# Altium project BaseStation.PrjPcb
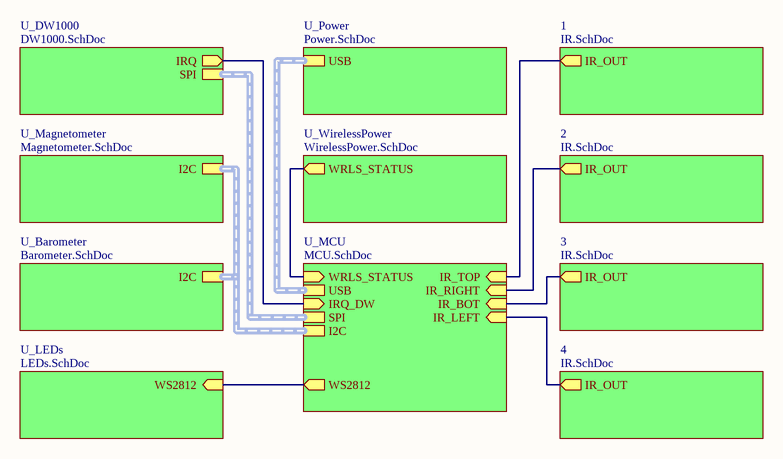
[diagram p0: BaseStation.SchDoc]
9 sheets, 157 parts. Net scope: hierarchical (ports join the sheet entries above them; power ports are global).
Board file: BaseStation.PcbDoc
Sheets:
  BaseStation.SchDoc
    U_MCU = MCU.SchDoc
    U_DW1000 = DW1000.SchDoc
    U_Barometer = Barometer.SchDoc
    1 = IR.SchDoc
    2 = IR.SchDoc
    3 = IR.SchDoc
    4 = IR.SchDoc
    U_LEDs = LEDs.SchDoc
    U_Magnetometer = Magnetometer.SchDoc
    U_Power = Power.SchDoc
    U_WirelessPower = WirelessPower.SchDoc

## Sheet BaseStation.SchDoc
size A; SheetNumber: 1

### Sub-sheets
1 = IR.SchDoc: IR_OUT (out)
2 = IR.SchDoc: IR_OUT (out)
3 = IR.SchDoc: IR_OUT (out)
4 = IR.SchDoc: IR_OUT (out)
U_Barometer = Barometer.SchDoc: I2C (harness I2C)
U_DW1000 = DW1000.SchDoc: SPI (harness SPI), IRQ (out)
U_LEDs = LEDs.SchDoc: WS2812 (in)
U_Magnetometer = Magnetometer.SchDoc: I2C (harness I2C)
U_MCU = MCU.SchDoc: USB (harness USB), I2C (harness I2C), SPI (harness SPI), WRLS_STATUS (in), IRQ_DW (in), WS2812 (out), IR_TOP (in), IR_BOT (in), IR_LEFT (in), IR_RIGHT (in)
U_Power = Power.SchDoc: USB (harness USB)
U_WirelessPower = WirelessPower.SchDoc: WRLS_STATUS (out)

### Nets
NetD4_4: sheet U_MCU/WS2812, sheet U_LEDs/WS2812
NetR37_2: sheet U_MCU/WRLS_STATUS, sheet U_WirelessPower/WRLS_STATUS
NetU4_45: sheet U_MCU/IRQ_DW, sheet U_DW1000/IRQ
NetU5_1_3: sheet U_MCU/IR_TOP, sheet 1/IR_OUT
NetU5_2_3: sheet U_MCU/IR_RIGHT, sheet 2/IR_OUT
NetU5_3_3: sheet U_MCU/IR_BOT, sheet 3/IR_OUT
NetU5_4_3: sheet U_MCU/IR_LEFT, sheet 4/IR_OUT

### Buses and harness runs
harness sheet U_Barometer/I2C = sheet U_Magnetometer/I2C = sheet U_MCU/I2C
harness sheet U_DW1000/SPI = sheet U_MCU/SPI
harness sheet U_MCU/USB = sheet U_Power/USB

## Sheet MCU.SchDoc
size A; SheetNumber: 2
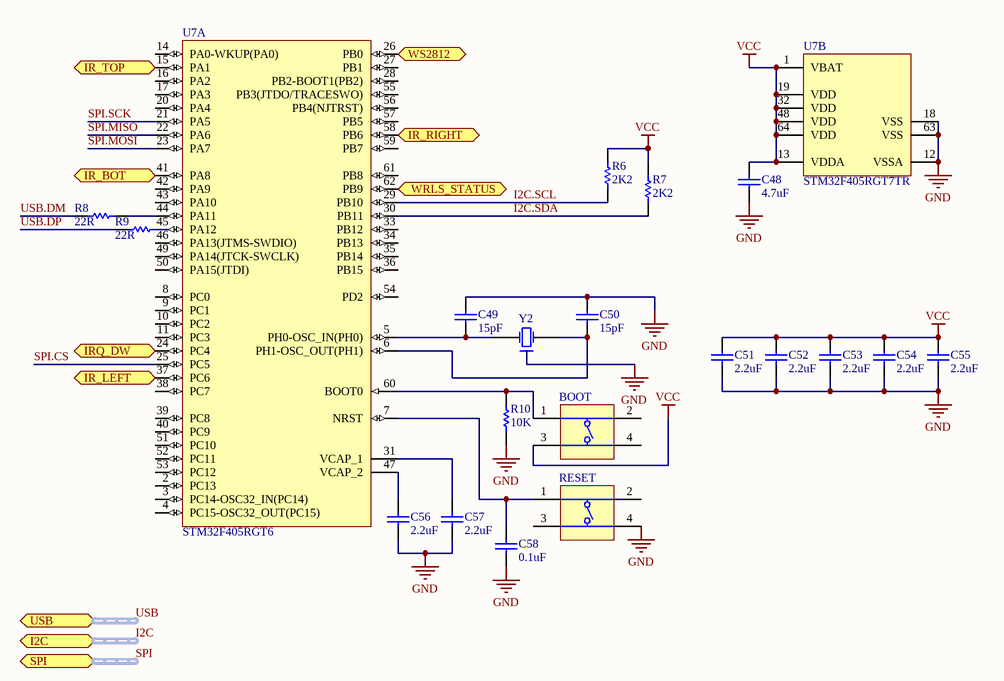
[diagram p1: MCU.SchDoc]

### Parts
BOOT  (no value)  [SWITCH]
C48  value 4.7uF  [C0402[1005X55]]  (hidden comment: 4.7uF 6.3V 0402)
C49  value 15pF  [C0402[1005X55]]  (hidden comment: 15pF 50V 0402)
C50  value 15pF  [C0402[1005X55]]  (hidden comment: 15pF 50V 0402)
C51  value 2.2uF  [C0402[1005X55]]  (hidden comment: 2.2uF 6.3V 0402)
C52  value 2.2uF  [C0402[1005X55]]  (hidden comment: 2.2uF 6.3V 0402)
C53  value 2.2uF  [C0402[1005X55]]  (hidden comment: 2.2uF 6.3V 0402)
C54  value 2.2uF  [C0402[1005X55]]  (hidden comment: 2.2uF 6.3V 0402)
C55  value 2.2uF  [C0402[1005X55]]  (hidden comment: 2.2uF 6.3V 0402)
C56  value 2.2uF  [C0402[1005X55]]  (hidden comment: 2.2uF 6.3V 0402)
C57  value 2.2uF  [C0402[1005X55]]  (hidden comment: 2.2uF 6.3V 0402)
C58  value 0.1uF  [C0402[1005X55]]  (hidden comment: 0.1uF 6.3V 0402)
R6  value 2K2  [R0402[1005]]  (hidden comment: 2K2 1% 0402)
R7  value 2K2  [R0402[1005]]  (hidden comment: 2K2 1% 0402)
R8  value 22R  [R0402[1005]]  (hidden comment: 22R 1% 0402)
R9  value 22R  [R0402[1005]]  (hidden comment: 22R 1% 0402)
R10  value 10K  [R0402[1005]]  (hidden comment: 10K 1% 0402)
RESET  (no value)  [SWITCH]
U7  STM32F405RGT6  [STM-LQFP64_L]  (parts A,B of 2)
Y2  (no value)  [ABRA-ABM3B-4_V]

### Ports
I2C (harness I2C), IR_BOT (in), IR_LEFT (in), IR_RIGHT (in), IR_TOP (in), IRQ_DW (in), SPI (harness SPI), USB (harness USB), WRLS_STATUS (in), WS2812 (out)

### Nets
GND: C48.1 C49.2 C50.2 C51.1 C52.1 C53.1 C54.1 C55.1 C56.1 C57.1 C58.1 R10.1 RESET.4(T3) U7.12(VSSA) U7.18(VSS) U7.63(VSS) Y2.2
VCC: BOOT.3(T3) C48.2 C51.2 C52.2 C53.2 C54.2 C55.2 R6.2 R7.2 U7.1(VBAT) U7.13(VDDA) U7.19(VDD) U7.32(VDD) U7.48(VDD) U7.64(VDD)
I2C.SCL: R6.1 U7.29(PB10)
I2C.SDA: R7.1 U7.30(PB11)
SPI.CS: U7.25(PC5)
SPI.MISO: U7.22(PA6)
SPI.MOSI: U7.23(PA7)
SPI.SCK: U7.21(PA5)
USB.DM: R8.1
USB.DP: R9.1
NetBOOT_1: BOOT.1(T1) R10.2 U7.60(BOOT0)
NetC49_1: C49.1 U7.5(PH0-OSC_IN(PH0)) Y2.3(X2)
NetC50_1: C50.1 U7.6(PH1-OSC_OUT(PH1)) Y2.1(X1)
NetC56_2: C56.2 U7.47(VCAP_2)
NetC57_2: C57.2 U7.31(VCAP_1)
NetC58_2: C58.2 RESET.1(T1) U7.7(NRST)
NetD4_4: U7.26(PB0) ; port WS2812
NetR8_2: R8.2 U7.44(PA11)
NetR9_2: R9.2 U7.45(PA12)
NetR37_2: U7.62(PB9) ; port WRLS_STATUS
NetU4_45: U7.24(PC4) ; port IRQ_DW
NetU5_1_3: U7.15(PA1) ; port IR_TOP
NetU5_2_3: U7.58(PB6) ; port IR_RIGHT
NetU5_3_3: U7.41(PA8) ; port IR_BOT
NetU5_4_3: U7.37(PC6) ; port IR_LEFT

Not connected (* = marked no-connect by the designer): BOOT 2(T2) 4(T3); RESET 2(T2) 3(T3); U7 2(PC13) 3(PC14-OSC32_IN(PC14)) 4(PC15-OSC32_OUT(PC15)) 8(PC0) 9(PC1) 10(PC2) 11(PC3) 14(PA0-WKUP(PA0)) 16(PA2) 17(PA3) 20(PA4) 27(PB1) 28(PB2-BOOT1(PB2)) 33(PB12) 34(PB13) 35(PB14) 36(PB15) 38(PC7) 39(PC8) 40(PC9) 42(PA9) 43(PA10) 46(PA13(JTMS-SWDIO)) 49(PA14(JTCK-SWCLK)) 50(PA15(JTDI)) 51(PC10) 52(PC11) 53(PC12) 54(PD2) 55(PB3(JTDO/TRACESWO)) 56(PB4(NJTRST)) 57(PB5) 59(PB7) 61(PB8)

### Buses and harness runs
harness I2C = port I2C
harness SPI = port SPI
harness USB = port USB

### Library data of the parts
BOOT RESET = DIPT-DTSM-6: Switch, SPNO Push Button SMD; Manufacturer: C&K Components; PartNumber: PTS810 SJM 250 SMTR LFS; Packing Type: Tape&Reel; Mechanical Life: 200,000 cycles; ComponentLink2URL: http://www.dip.com.tw/Products_tact.htm; ComponentLink1URL: http://www.dip.com.tw/; ComponentLink3URL: http://www.dip.com.tw/PDF/pro_tact/DTSM_G_-6_2_-V.pdf; PackageDescription: Switch, Surface Mount, 4 Leads, Body 4.6x2.8mm, Height 1.9mm; ComponentLink2Description: Datasheet; ComponentLink3Description: Package Specification; ComponentLink1Description: Manufacturer URL; PackageReference: PTS810; Mounting Technology: Surface Mount
C48 = CAP_4.7uF_6.3V_0402_20%: 4.7uF 6.3V 20% 0402 (1005 Metric); PartNumber: GRM155R60J475ME47D; Manufacturer: Murata; Tolerance: 20%; Mounting Technology: Surface Mount; PackageReference: 0402; PackageDescription: 0402 (1005 Metric); Voltage: 6.3V
C49 C50 = CAP_15pF_50V_0402_5%: 15pF 50V 5% 0402 (1005 Metric); PartNumber: GRM1555C1H150JA01D; Manufacturer: Murata; Tolerance: 5%; Mounting Technology: Surface Mount; PackageReference: 0402; PackageDescription: 0402 (1005 Metric); Voltage: 50V
C51-C57 = CAP_2.2uF_6.3V_0402_20%: 2.2uF 6.3V 20% 0402 (1005 Metric); PartNumber: GRM155R60J225ME15D; Manufacturer: Murata; Tolerance: 20%; Mounting Technology: Surface Mount; PackageReference: 0402; PackageDescription: 0402 (1005 Metric); Voltage: 6.3V
C58 = CAP_0.1uF_6.3V_0402_10%: 0.1uF 6.3V 10% 0402 (1005 Metric); PartNumber: GRM155R70J104KA01D; Manufacturer: Murata; Tolerance: 10%; Mounting Technology: Surface Mount; PackageReference: 0402; PackageDescription: 0402 (1005 Metric); Voltage: 6.3V
R6 R7 = RES_2K2_0402_1%: 2K2 0.063W 1% 0402 (1005 Metric); Manufacturer: KOA Speer; PartNumber: RK73H1ETTP2201F; Tolerance: 1%; Power: 0.063W; Mounting Technology: Surface Mount; PackageReference: 0402; PackageDescription: 0402 (1005 Metric); ComponentLink1Description: Datasheet; ComponentLink1URL: http://www.koaspeer.com/catimages/Products/RK73H/RK73H.pdf
R8 R9 = RES_22R_0402_1%: 22R 0.063W 1% 0402 (1005 Metric); Manufacturer: KOA Speer; PartNumber: RK73H1ETTP22R0F; Power: 0.063W; Tolerance: 1%; Mounting Technology: Surface Mount; PackageReference: 0402; PackageDescription: 0402 (1005 Metric); ComponentLink1Description: Datasheet; ComponentLink1URL: http://www.koaspeer.com/catimages/Products/RK73H/RK73H.pdf
R10 = RES_10K_0402_1%: 10K 0.063W 1% 0402 (1005 Metric); Manufacturer: KOA Speer; PartNumber: RK73H1ETTP1002F; Tolerance: 1%; Power: 0.063W; Mounting Technology: Surface Mount; PackageReference: 0402; PackageDescription: 0402 (1005 Metric); ComponentLink1Description: Datasheet; ComponentLink1URL: http://www.koaspeer.com/catimages/Products/RK73H/RK73H.pdf
U7 = CMP-0243-00089-2: ARM Cortex-M4 32-bit MCU+FPU, 210 DMIPS, 1024 kB Flash, 192 kB Internal RAM, 51 I/Os, 64-pin LQFP, -40 to 105 degC, Tape and Reel; Manufacturer: STMicroelectronics; FLASH Size (Prog) (kB): 1024; Supply Voltage(Vcc) max (V): 3.6; Internal RAM Size (kB): 192; Supply Voltage(Vcc) min (V): 1.8; Operating Frequency(F) (Processor speed) (MHz): 168; D/A Converter: 2x12-bit; I/Os (High Current): 51; ComponentLink2Description: Datasheet; Core: ARM Cortex-M4; PackageVersion: Rev. 4, 06/2013; ComponentLink1URL: http://www.st.com/web/en/home.html; PackageReference: LQFP64; Mounting Technology: Surface Mount; ComponentLink1Description: Manufacturer URL; PackageDescription: 64-Pin Low Profile Quad Flat Package, 10 x 10 mm Body, 0.5 mm Pitch; ComponentLink3Description: Package Specification; ComponentLink2URL: http://www.st.com/st-web-ui/static/active/en/resource/technical/document/datasheet/DM00037051.pdf; PartNumber: STM32F405RGT6; ComponentLink3URL: http://www.st.com/st-web-ui/static/active/en/resource/technical/document/datasheet/DM00037051.pdf; Packing: Tape and Reel; DatasheetVersion: Rev. 4; PartId: 1
Y2 = ABRA-ABM3B-4: PartNumber: ABM3B-8.000MHZ-10-1UT; Manufacturer: ABRACON; Mounting Technology: Surface Mount; PackageReference: 2012; PackageDescription: 2012 (5032 metric)

## Sheet DW1000.SchDoc
size A; SheetNumber: 5
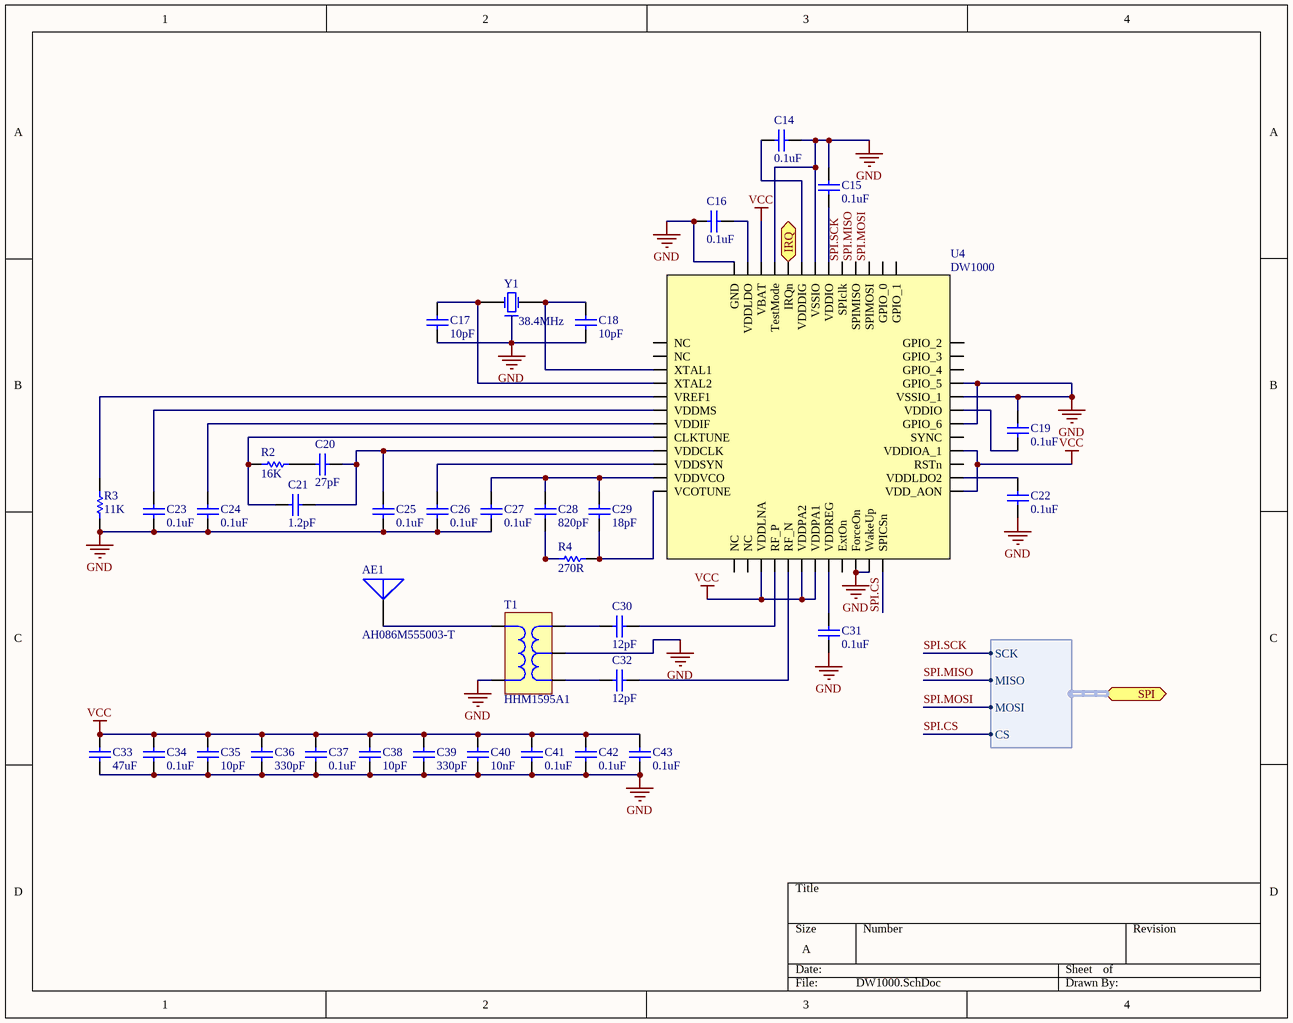
[diagram p2: DW1000.SchDoc]

### Parts
AE1  AH086M555003-T  [AH086M555003-T]
C14  value 0.1uF  [C0402[1005X55]]  (hidden comment: 0.1uF 6.3V 0402)
C15  value 0.1uF  [C0402[1005X55]]  (hidden comment: 0.1uF 6.3V 0402)
C16  value 0.1uF  [C0402[1005X55]]  (hidden comment: 0.1uF 6.3V 0402)
C17  value 10pF  [C0402[1005X55]]  (hidden comment: 10pF 50V 0402)
C18  value 10pF  [C0402[1005X55]]  (hidden comment: 10pF 50V 0402)
C19  value 0.1uF  [C0402[1005X55]]  (hidden comment: 0.1uF 6.3V 0402)
C20  value 27pF  [C0402[1005X55]]  (hidden comment: 27pF 50V 0402)
C21  value 1.2pF  [C0402[1005X55]]  (hidden comment: 1.2pF 50V 0402)
C22  value 0.1uF  [C0402[1005X55]]  (hidden comment: 0.1uF 6.3V 0402)
C23  value 0.1uF  [C0402[1005X55]]  (hidden comment: 0.1uF 6.3V 0402)
C24  value 0.1uF  [C0402[1005X55]]  (hidden comment: 0.1uF 6.3V 0402)
C25  value 0.1uF  [C0402[1005X55]]  (hidden comment: 0.1uF 6.3V 0402)
C26  value 0.1uF  [C0402[1005X55]]  (hidden comment: 0.1uF 6.3V 0402)
C27  value 0.1uF  [C0402[1005X55]]  (hidden comment: 0.1uF 6.3V 0402)
C28  value 820pF  [C0402[1005X55]]  (hidden comment: 820pF 50V 0402)
C29  value 18pF  [C0402[1005X55]]  (hidden comment: 18pF 50V 0402)
C30  value 12pF  [C0402[1005X55]]  (hidden comment: 12pF 50V 0402)
C31  value 0.1uF  [C0402[1005X55]]  (hidden comment: 0.1uF 6.3V 0402)
C32  value 12pF  [C0402[1005X55]]  (hidden comment: 12pF 50V 0402)
C33  value 47uF  [C1206[3216X160]]  (hidden comment: 47uF 6.3V 1206)
C34  value 0.1uF  [C0402[1005X55]]  (hidden comment: 0.1uF 6.3V 0402)
C35  value 10pF  [C0402[1005X55]]  (hidden comment: 10pF 50V 0402)
C36  value 330pF  [C0402[1005X55]]  (hidden comment: 330pF 50V 0402)
C37  value 0.1uF  [C0402[1005X55]]  (hidden comment: 0.1uF 6.3V 0402)
C38  value 10pF  [C0402[1005X55]]  (hidden comment: 10pF 50V 0402)
C39  value 330pF  [C0402[1005X55]]  (hidden comment: 330pF 50V 0402)
C40  value 10nF  [C0402[1005X55]]  (hidden comment: 10nF 50V 0402)
C41  value 0.1uF  [C0402[1005X55]]  (hidden comment: 0.1uF 6.3V 0402)
C42  value 0.1uF  [C0402[1005X55]]  (hidden comment: 0.1uF 6.3V 0402)
C43  value 0.1uF  [C0402[1005X55]]  (hidden comment: 0.1uF 6.3V 0402)
R2  value 16K  [R0402[1005]]  (hidden comment: 16K 1% 0402)
R3  value 11K  [R0402[1005]]  (hidden comment: 11K 1% 0402)
R4  value 270R  [R0402[1005]]  (hidden comment: 270R 1% 0402)
T1  HHM1595A1  [HHM1595A1]
U4  DW1000  [QFN-48]
Y1  38.4MHz  [ABRA-ABM10]

### Ports
IRQ (out), SPI (harness SPI)

### Harnesses
SPI: SCK, MISO, MOSI, CS

### Nets
GND: C14.1 C15.2 C16.2 C17.1 C18.1 C19.2 C22.1 C23.1 C24.1 C25.1 C26.1 C27.1 C31.1 C33.1 C34.1 C35.1 C36.1 C37.1 C38.1 C39.1 C40.1 C41.1 C42.1 C43.1 R3.1 T1.2 T1.5 U4.22(ForceOn) U4.23(WakeUp) U4.30(GPIO_6) U4.32(VSSIO_1) U4.33(GPIO_5) U4.43(VSSIO) U4.46(TestMode) U4.49(GND) Y1.2
VCC: C33.2 C34.2 C35.2 C36.2 C37.2 C38.2 C39.2 C40.2 C41.2 C42.2 C43.2 U4.15(VDDLNA) U4.18(VDDPA2) U4.19(VDDPA1) U4.25(VDD_AON) U4.28(VDDIOA_1) U4.47(VBAT)
SPI.CS: U4.24(SPICSn) ; port SPI.CS
SPI.MISO: U4.40(SPIMISO) ; port SPI.MISO
SPI.MOSI: U4.39(SPIMOSI) ; port SPI.MOSI
SPI.SCK: U4.41(SPIclk) ; port SPI.SCK
NetAE1_1: AE1.1 T1.1
NetC14_2: C14.2 U4.44(VDDDIG)
NetC15_1: C15.1 U4.42(VDDIO)
NetC16_1: C16.1 U4.48(VDDLDO)
NetC17_2: C17.2 U4.4(XTAL2) Y1.1(X1)
NetC18_2: C18.2 U4.3(XTAL1) Y1.3(X2)
NetC19_1: C19.1 U4.31(VDDIO)
NetC20_1: C20.1 C21.1 C25.2 U4.9(VDDCLK)
NetC20_2: C20.2 R2.1
NetC21_2: C21.2 R2.2 U4.8(CLKTUNE)
NetC22_2: C22.2 U4.26(VDDLDO2)
NetC23_2: C23.2 U4.6(VDDMS)
NetC24_2: C24.2 U4.7(VDDIF)
NetC26_2: C26.2 U4.10(VDDSYN)
NetC27_2: C27.2 C28.2 C29.2 U4.11(VDDVCO)
NetC28_1: C28.1 R4.1
NetC29_1: C29.1 R4.2 U4.12(VCOTUNE)
NetC30_1: C30.1 T1.4
NetC30_2: C30.2 U4.16(RF_P)
NetC31_2: C31.2 U4.20(VDDREG)
NetC32_1: C32.1 T1.3
NetC32_2: C32.2 U4.17(RF_N)
NetR3_2: R3.2 U4.5(VREF1)
NetU4_45: U4.45(IRQn) ; port IRQ

Not connected (* = marked no-connect by the designer): U4 1(NC) 2(NC) 13(NC) 14(NC) 21(ExtOn) 27(RSTn) 29(SYNC) 34(GPIO_4) 35(GPIO_3) 36(GPIO_2) 37(GPIO_1) 38(GPIO_0)

### Library data of the parts
AE1 = AH086M555003-T: Manufacturer: Taiyo Yuden; PartNumber: AH086M555003-T; Mounting Technology: Surface Mount
C14-C16 C19 C22-C27 C31 C34 C37 C41-C43 = CAP_0.1uF_6.3V_0402_10%: as C58 on sheet MCU; Mounting Technology: Surface Mount; PackageReference: 0402; PackageDescription: 0402 (1005 Metric); Voltage: 6.3V; Tolerance: 10%
C17 C18 C35 C38 = CAP_10pF_50V_0402_1%: 10pF 50V 1% 0402 (1005 Metric); PartNumber: GRM1555C1H100FA01D; Manufacturer: Murata; Mounting Technology: Surface Mount; PackageReference: 0402; PackageDescription: 0402 (1005 Metric); Voltage: 50V; Tolerance: 1%
C20 = CAP_27pF_50V_0402_1%: 27pF 50V 1% 0402 (1005 Metric); PartNumber: GRM1555C1H270FA01D; Manufacturer: Murata; Mounting Technology: Surface Mount; PackageReference: 0402; PackageDescription: 0402 (1005 Metric); Voltage: 50V; Tolerance: 1%
C21 = CAP_1.2pF_50V_0402_0.05pF: 1.2pF 50V 0.05pF 0402 (1005 Metric); PartNumber: GRM1555C1H1R2WA01D; Manufacturer: Murata; Mounting Technology: Surface Mount; PackageReference: 0402; PackageDescription: 0402 (1005 Metric); Voltage: 50V; Tolerance: 0.05pF
C28 = CAP_820pF_50V_0402_5%: 820pF 50V 5% 0402 (1005 Metric); PartNumber: GRM1555C1H821JA01D; Manufacturer: Murata; Mounting Technology: Surface Mount; PackageReference: 0402; PackageDescription: 0402 (1005 Metric); Voltage: 50V; Tolerance: 5%
C29 = CAP_18pF_50V_0402_1%: 18pF 50V 1% 0402 (1005 Metric); PartNumber: GRM1555C1H180FA01D; Manufacturer: Murata; Mounting Technology: Surface Mount; PackageReference: 0402; PackageDescription: 0402 (1005 Metric); Voltage: 50V; Tolerance: 1%
C30 C32 = CAP_12pF_50V_0402_5%: 12pF 50V 5% 0402 (1005 Metric); PartNumber: GRM1555C1H120JA01D; Manufacturer: Murata; Mounting Technology: Surface Mount; PackageReference: 0402; PackageDescription: 0402 (1005 Metric); Voltage: 50V; Tolerance: 5%
C33 = CAP_47uF_6.3V_1206_10%: 47uF 6.3V 10% 1206 (3216 Metric); PartNumber: GRM31CR60J476KE19L; Manufacturer: Murata; Mounting Technology: Surface Mount; PackageReference: 1206; PackageDescription: 1206 (3216 Metric); Voltage: 6.3V; Tolerance: 10%
C36 C39 = CAP_330pF_50V_0402_5%: 330pF 50V 5% 0402 (1005 Metric); PartNumber: GRM1555C1H331JA01D; Manufacturer: Murata; Mounting Technology: Surface Mount; PackageReference: 0402; PackageDescription: 0402 (1005 Metric); Voltage: 50V; Tolerance: 5%
C40 = CAP_10nF_50V_0402_10%: 10nF 50V 10% 0402 (1005 Metric); PartNumber: GCM155R71H103KA55D; Manufacturer: Murata; Mounting Technology: Surface Mount; PackageReference: 0402; PackageDescription: 0402 (1005 Metric); Voltage: 50V; Tolerance: 10%
R2 = RES_16K_0402_1%: 16K 0.063W 1% 0402 (1005 Metric); Manufacturer: KOA Speer; PartNumber: RK73H1ETTP1602F; Tolerance: 1%; Power: 0.063W; Mounting Technology: Surface Mount; PackageReference: 0402; PackageDescription: 0402 (1005 Metric); ComponentLink1Description: Datasheet; ComponentLink1URL: http://www.koaspeer.com/catimages/Products/RK73H/RK73H.pdf
R3 = RES_11K_0402_1%: 11K 0.063W 1% 0402 (1005 Metric); Manufacturer: KOA Speer; PartNumber: RK73H1ETTP1102F; Tolerance: 1%; Power: 0.063W; Mounting Technology: Surface Mount; PackageReference: 0402; PackageDescription: 0402 (1005 Metric); ComponentLink1Description: Datasheet; ComponentLink1URL: http://www.koaspeer.com/catimages/Products/RK73H/RK73H.pdf
R4 = RES_270R_0402_1%: 270R 0.063W 1% 0402 (1005 Metric); Manufacturer: KOA Speer; PartNumber: RK73H1ETTP2700F; Tolerance: 1%; Power: 0.063W; Mounting Technology: Surface Mount; PackageReference: 0402; PackageDescription: 0402 (1005 Metric); ComponentLink1Description: Datasheet; ComponentLink1URL: http://www.koaspeer.com/catimages/Products/RK73H/RK73H.pdf
T1 = HHM1595A1: Manufacturer: TDK; PartNumber: HHM1595A1; PackageReference: 0805; Mounting Technology: Surface Mount
U4 = DW1000: UWB DW1000; Part Number: DW1000-I-TR13; Manufacturer: Decawave Limited; PackageReference: QFN-48; Mounting Technology: Surface Mount
Y1 = ABM10-165-38.400MHZ-T3: Manufacturer: ABRACON; PartNumber: ABM10-165-38.400MHZ-T3; Mounting Technology: Surface Mount; PackageReference: 4-SMD; PackageDescription: 4-SMD, No Lead (DFN, LCC)

## Sheet Barometer.SchDoc
size A; SheetNumber: 6
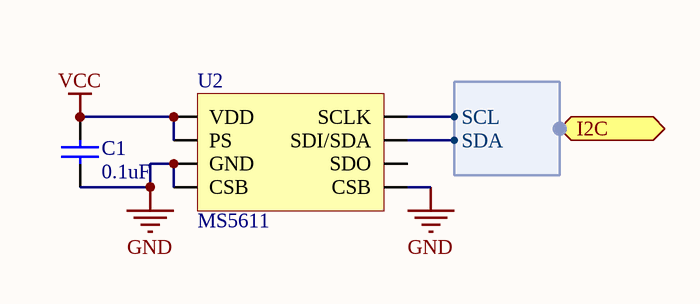
[diagram p3: Barometer.SchDoc]

### Parts
C1  value 0.1uF  [C0402[1005X55]]  (hidden comment: 0.1uF 6.3V 0402)
U2  MS5611  [MS5611]

### Ports
I2C (harness I2C)

### Harnesses
I2C: SCL, SDA

### Nets
GND: C1.1 U2.3(GND) U2.4(CSB) U2.5(CSB)
VCC: C1.2 U2.1(VDD) U2.2(PS)
I2C.SCL: U2.8(SCLK) ; port I2C.SCL
I2C.SDA: U2.7(SDI/SDA) ; port I2C.SDA

Not connected (* = marked no-connect by the designer): U2 6(SDO)

### Library data of the parts
C1 = CAP_0.1uF_6.3V_0402_10%: as C58 on sheet MCU; Tolerance: 10%; Mounting Technology: Surface Mount; PackageReference: 0402; PackageDescription: 0402 (1005 Metric); Voltage: 6.3V

## Sheet IR.SchDoc
size A; SheetNumber: 8
Used 4 times, as channels 1, 2, 3, 4. Parts and nets are listed once, with the designators drawn on the sheet.
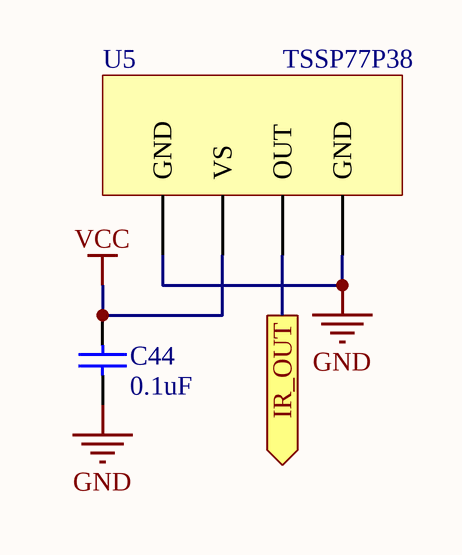
[diagram p4: IR.SchDoc]

### Parts
C44  value 0.1uF  [C0402[1005X55]]  (hidden comment: 0.1uF 6.3V 0402)
U5  TSSP77P38  [TSSP77P38]

### Ports
IR_OUT (out)

### Nets
GND: C44.1 U5.1(GND) U5.4(GND)
VCC: C44.2 U5.2(VS)
IR_OUT: U5.3(OUT) ; port IR_OUT

### Channels
1: designators end in _1; ports IR_OUT=NetU5_1_3
2: designators end in _2; ports IR_OUT=NetU5_2_3
3: designators end in _3; ports IR_OUT=NetU5_3_3
4: designators end in _4; ports IR_OUT=NetU5_4_3

### Library data of the parts
C44 = CAP_0.1uF_6.3V_0402_10%: as C58 on sheet MCU; Mounting Technology: Surface Mount; PackageReference: 0402; PackageDescription: 0402 (1005 Metric); Voltage: 6.3V; Tolerance: 10%
U5 = TSSP77P38: Manufacturer: Vishay; PartNumber: TSSP77P38; Mounting Technology: Surface Mount

## Sheet LEDs.SchDoc
size A; SheetNumber: 9
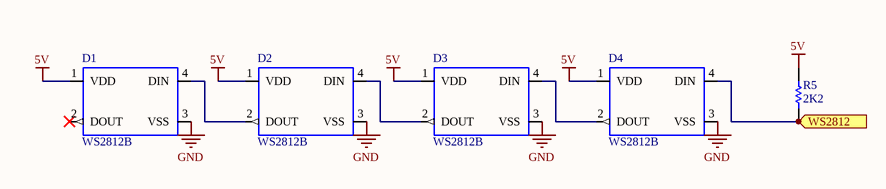
[diagram p5: LEDs.SchDoc]

### Parts
D1  WS2812B  [WS2812B]
D2  WS2812B  [WS2812B]
D3  WS2812B  [WS2812B]
D4  WS2812B  [WS2812B]
R5  value 2K2  [R0402[1005]]  (hidden comment: 2K2 1% 0402)

### Ports
WS2812 (in)

### Nets
5V: D1.1(VDD) D2.1(VDD) D3.1(VDD) D4.1(VDD) R5.2
GND: D1.3(VSS) D2.3(VSS) D3.3(VSS) D4.3(VSS)
NetD1_4: D1.4(DIN) D2.2(DOUT)
NetD2_4: D2.4(DIN) D3.2(DOUT)
NetD3_4: D3.4(DIN) D4.2(DOUT)
NetD4_4: D4.4(DIN) R5.1 ; port WS2812

Not connected (* = marked no-connect by the designer): D1 2(DOUT)*

### Library data of the parts
R5 = RES_2K2_0402_1%: as R6 on sheet MCU; Tolerance: 1%; Power: 0.063W; Mounting Technology: Surface Mount; PackageReference: 0402; PackageDescription: 0402 (1005 Metric); ComponentLink1Description: Datasheet; ComponentLink1URL: http://www.koaspeer.com/catimages/Products/RK73H/RK73H.pdf
D1-D4 = WS2812B: PartNumber: WS2812B

## Sheet Magnetometer.SchDoc
size A; SheetNumber: 7
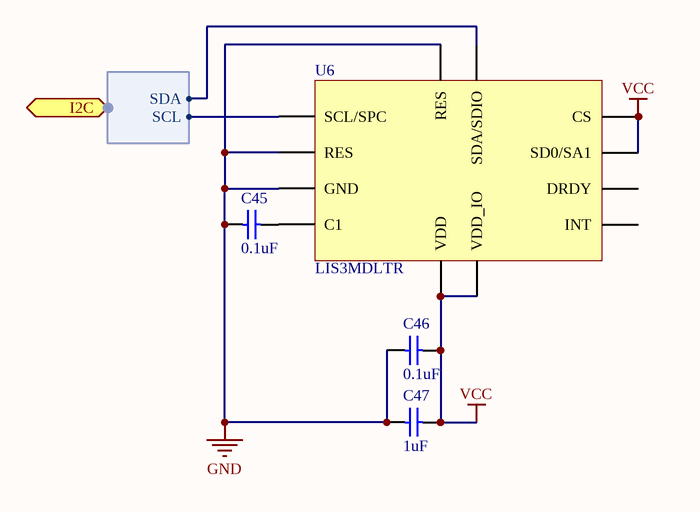
[diagram p6: Magnetometer.SchDoc]

### Parts
C45  value 0.1uF  [C0402[1005X55]]  (hidden comment: 0.1uF 6.3V 0402)
C46  value 0.1uF  [C0402[1005X55]]  (hidden comment: 0.1uF 6.3V 0402)
C47  value 1uF  [C0402[1005X55]]  (hidden comment: 1uF 6.3V 0402)
U6  LIS3MDLTR  [LGA-12 (2x2MM)]

### Ports
I2C (harness I2C)

### Harnesses
I2C: SCL, SDA

### Nets
GND: C45.1 C46.1 C47.1 U6.2(RES) U6.3(GND) U6.12(RES)
VCC: C46.2 C47.2 U6.5(VDD) U6.6(VDD_IO) U6.9(SD0/SA1) U6.10(CS)
I2C.SCL: U6.1(SCL/SPC) ; port I2C.SCL
I2C.SDA: U6.11(SDA/SDIO) ; port I2C.SDA
NetC45_2: C45.2 U6.4(C1)

Not connected (* = marked no-connect by the designer): U6 7(INT) 8(DRDY)

### Library data of the parts
C45 C46 = CAP_0.1uF_6.3V_0402_10%: as C58 on sheet MCU; Mounting Technology: Surface Mount; PackageReference: 0402; PackageDescription: 0402 (1005 Metric); Voltage: 6.3V; Tolerance: 10%
C47 = CAP_1uF_6.3V_0402_10%: 1uF 6.3V 10% 0402 (1005 Metric); PartNumber: GRM155R70J105KA12D; Manufacturer: Murata; Mounting Technology: Surface Mount; PackageReference: 0402; PackageDescription: 0402 (1005 Metric); Voltage: 6.3V; Tolerance: 10%
U6 = LIS3MDLTR: Board Mount Hall Effect / Magnetic Sensors Ultra Lo-Pwr Hi Perf 3-Axis 1.9-3.6V; Manufacturer: STMicroelectronics; PartNumber: LIS3MDLTR; Mounting Technology: Surface Mount; PackageReference: LGA-12

## Sheet Power.SchDoc
size A; SheetNumber: 3
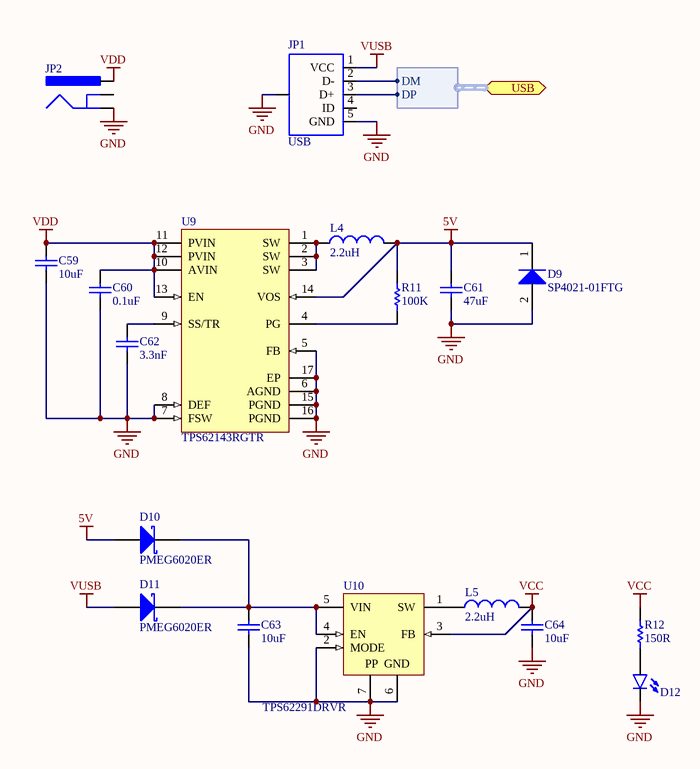
[diagram p7: Power.SchDoc]

### Parts
C59  value 10uF  [C1206[3216X160]]  (hidden comment: 10uF 50V 1206)
C60  value 0.1uF  [C0402[1005X55]]  (hidden comment: 0.1uF 100V 0402)
C61  value 47uF  [C1210[3225X250]]  (hidden comment: 47uF 6.3V 1210)
C62  value 3.3nF  [C0402[1005X55]]  (hidden comment: 3.3nF 50V 0402)
C63  value 10uF  [C0402[1005X55]]  (hidden comment: 10uF 6.3V 0402)
C64  value 10uF  [C0402[1005X55]]  (hidden comment: 10uF 6.3V 0402)
D9  SP4021-01FTG  [SOD-323]
D10  PMEG6020ER  [SOD-123]
D11  PMEG6020ER  [SOD-123]
D12  LED_0603_GREEN_5mA  [LED0603]  (value not drawn)
JP1  USB  [USB-MICROB]
JP2  (no value)  [POWER_JACK_SMD]
L4  2.2uH  [IND0805]
L5  2.2uH  [IND0805]
R11  value 100K  [R0402[1005]]  (hidden comment: 100K 1% 0402)
R12  value 150R  [R0402[1005]]  (hidden comment: 150R 1% 0402)
U9  TPS62143RGTR  [RGT0016C_V]
U10  TPS62291DRVR  [WSON-6]

### Ports
USB (harness USB)

### Harnesses
USB: DM, DP

### Nets
5V: C61.2 D9.1(K) D10.2(A) L4.2 R11.2 U9.14(VOS)
GND: C59.1 C60.1 C61.1 C62.1 C63.1 C64.1 D9.2(A) D12.C JP1.5(GND) JP1.6(SHIELD) JP2.2(GND) U9.5(FB) U9.6(AGND) U9.7(FSW) U9.8(DEF) U9.15(PGND) U9.16(PGND) U9.17(EP) U10.2(MODE) U10.6(GND) U10.7(EP)
VCC: C64.2 L5.2 R12.2 U10.3(FB)
VDD: C59.2 C60.2 JP2.1(PWR) U9.10(AVIN) U9.11(PVIN) U9.12(PVIN) U9.13(EN)
VUSB: D11.2(A) JP1.1(VCC)
USB.DM: JP1.2(D-) ; port USB.DM
USB.DP: JP1.3(D+) ; port USB.DP
NetC62_2: C62.2 U9.9(SS/TR)
NetC63_2: C63.2 D10.1(K) D11.1(K) U10.4(EN) U10.5(VIN)
NetD12_A: D12.A R12.1
NetL4_1: L4.1 U9.1(SW) U9.2(SW) U9.3(SW)
NetL5_1: L5.1 U10.1(SW)
NetR11_1: R11.1 U9.4(PG)

Not connected (* = marked no-connect by the designer): JP1 4(ID); JP2 3(GND)

### Notes on the sheet
- (in symbol TPS62291DRVR) PP

### Library data of the parts
C59 = CAP_10uF_50V_1206_20%: 10uF 50V 20% 1206 (3216 Metric); PartNumber: UMK316BBJ106ML-T; Manufacturer: Taiyo Yuden; Tolerance: 20%; Mounting Technology: Surface Mount; PackageReference: 1206; PackageDescription: 1206 (3216 Metric); Voltage: 50V
C60 = CAP_0.1uF_100V_0402_10%: 0.1uF 100V 10% 0402 (1005 Metric); PartNumber: GRM155R62A104KE14D; Manufacturer: Murata; Tolerance: 10%; Mounting Technology: Surface Mount; PackageReference: 0402; PackageDescription: 0402 (1005 Metric); Voltage: 100V
C61 = CAP_47uF_6.3V_1210_10%: 47uF 6.3V 10% 1210 (3225 Metric); PartNumber: GRM32ER70J476KE20L; Manufacturer: Murata; Tolerance: 10%; Mounting Technology: Surface Mount; PackageReference: 1210; PackageDescription: 1210 (3225 Metric); Voltage: 6.3V
C62 = CAP_3.3nF_50V_0402_10%: 3.3nF 50V 10% 0402 (1005 Metric); PartNumber: GRM155R71H332KA01D; Manufacturer: Murata; Tolerance: 10%; Mounting Technology: Surface Mount; PackageReference: 0402; PackageDescription: 0402 (1005 Metric); Voltage: 50V
C63 C64 = CAP_10uF_6.3V_0402_20%: 10uF 6.3V 20% 0402 (1005 Metric); PartNumber: GRM155R60J106ME44D; Manufacturer: Murata; Tolerance: 20%; Mounting Technology: Surface Mount; PackageReference: 0402; PackageDescription: 0402 (1005 Metric); Voltage: 6.3V
D9 = SP4021-01FTG: Manufacturer: Littelfuse; PartNumber: SP4021-01FTG; PackageReference: SOD-323-2; Mounting Technology: Surface Mount
D10 D11 = PMEG6020ER: PartNumber: PMEG6020ER,115; Manufacturer: NXP Semiconductors; PackageReference: SOD-123W; PackageDescription: SOD, 2-Leads, Body 2.69x1.6mm; Mounting Technology: Surface Mount
D12 = LED_0603_GREEN_5mA: PartNumber: LTST-C193TGKT-5A; Manufacturer: Lite-On Inc.; PackageReference: 0603; PackageDescription: 0603 (1608 Metric); Mounting Technology: Surface Mount
JP1 = USB_MICROB_SMT: pin to pad: 1>VBUS 2>D- 3>D+ 4>ID 5>GND 6>MT1+P$1+P$2+MT2; PartNumber: 10118192-0001LF; Manufacturer: Amphenol FCI; Mounting Technology: Surface Mount; PackageReference: USB - Micro B
JP2 = POWER_JACK
L4 L5 = IND_2.2uH_1.7A_0805_20%: 2.2uH 20% 1.7A 0805; PartNumber: LQM21PN2R2MGHL; Manufacturer: Murata; PackageReference: 0805; PackageDescription: 0805 (2012 metric); Value: 2.2uH; Mounting Technology: Surface Mount; Current: 1.7A
R11 = RES_100K_0402_1%: 100K 0.063W 1% 0402 (1005 Metric); Manufacturer: KOA Speer; PartNumber: RK73H1ETTP1003F; Tolerance: 1%; Power: 0.063W; Mounting Technology: Surface Mount; PackageReference: 0402; PackageDescription: 0402 (1005 Metric); ComponentLink1Description: Datasheet; ComponentLink1URL: http://www.koaspeer.com/catimages/Products/RK73H/RK73H.pdf
R12 = RES_150R_0402_1%: 150R 0.063W 1% 0402 (1005 Metric); Manufacturer: KOA Speer; PartNumber: RK73H1ETTP1500F; Power: 0.063W; Tolerance: 1%; Mounting Technology: Surface Mount; PackageReference: 0402; PackageDescription: 0402 (1005 Metric); ComponentLink1Description: Datasheet; ComponentLink1URL: http://www.koaspeer.com/catimages/Products/RK73H/RK73H.pdf
U9 = CMP-0323-00146-3: Buck Step Down Regulator with 3 to 17 V Input and 5 V Output, -40 to 85 degC, 16-Pin QFN (RGT), Green (RoHS & no Sb/Br); Manufacturer: Texas Instruments; Preset Vout(V): 5; Regulated Outputs(#): 1; Synchronous Rectification: TRUE; Duty Cycle(Max)(%): 100; Vin(Min)(V): 3; Vin(Max)(V): 17; Rating: Catalog; SubFamily: Step-Down Regulator; Switch Current Limit(Typ)(A): 4.2; Iout(Max)(A): 2; Iq(Typ)(mA): 0.017; ComponentLink1Description: Datasheet; PackageVersion: revH, Oct-2011; ComponentLink2URL: http://www.ti.com/litv/pdf/mpqf119g; Code_JEDEC: MO-220; ComponentLink2Description: Package Specification; Vout(Max)(V): 5; ComponentLink3URL: Samples URL:http://www.ti.com/product/tps62133#samples; PackageReference: RGT0016C; ComponentLink3Description: URL Link1; Mounting Technology: Surface Mount; DatasheetVersion: SLVSAG7; PartNumber: TPS62143RGTR; Eco-Plan: Green (RoHS & no Sb/Br); PackageDescription: 16-Pin Plastic Quad Flat No-Lead, 3 x 3 mm Body, 0.5 mm Pitch, 1.7 x 1.7 mm Exposed Pad; Topology: Buck; Vout(Min)(V): 5; ComponentLink1URL: http://www.ti.com/general/docs/lit/getliterature.tsp?genericPartNumber=TPS62133&fileType=pdf
U10 = TPS62291DRVR: Voltage Regulators - Switching Regulators 2.25MHz 1A Step-Down Cnvrtr 3.3V Output; Manufacturer: Texas Instruments; PartNumber: TPS62291DRVR; PackageReference: WSON-6; PackageDescription: SON, 6-Leads, Body 2x2mm, Pitch 0.65mm, Thermal Pad 1.6x1mm, TI Recommended; Mounting Technology: Surface Mount

## Sheet WirelessPower.SchDoc
size A; SheetNumber: 4
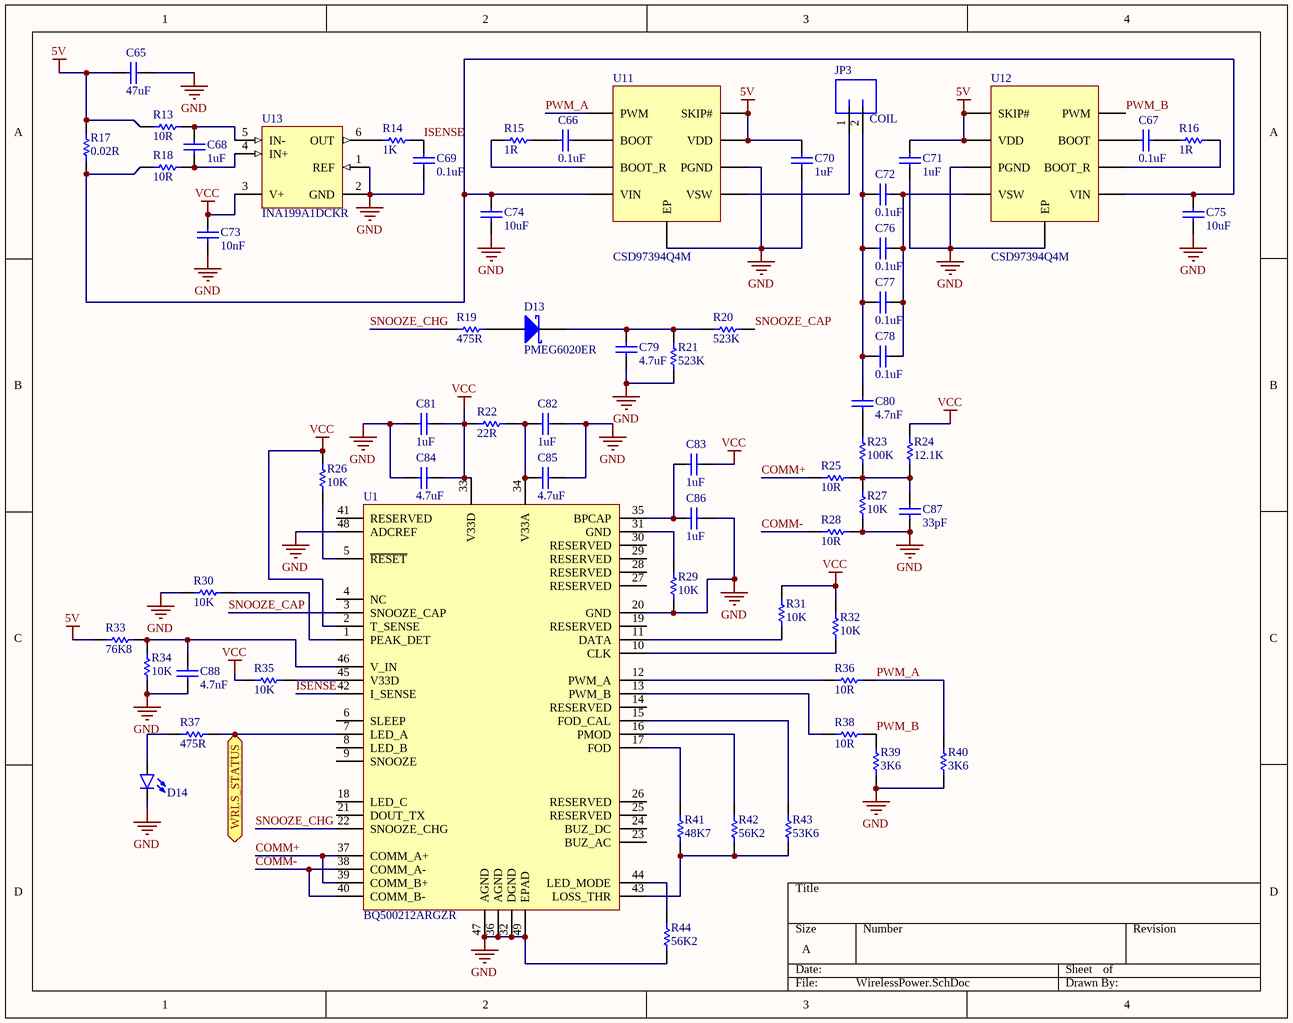
[diagram p8: WirelessPower.SchDoc]

### Parts
C65  value 47uF  [C1210[3225X250]]  (hidden comment: 47uF 6.3V 1210)
C66  value 0.1uF  [C0402[1005X55]]  (hidden comment: 0.1uF 100V 0402)
C67  value 0.1uF  [C0402[1005X55]]  (hidden comment: 0.1uF 100V 0402)
C68  value 1uF  [C0402[1005X55]]  (hidden comment: 1uF 6.3V 0402)
C69  value 0.1uF  [C0402[1005X55]]  (hidden comment: 0.1uF 6.3V 0402)
C70  value 1uF  [C0402[1005X55]]  (hidden comment: 1uF 6.3V 0402)
C71  value 1uF  [C0402[1005X55]]  (hidden comment: 1uF 6.3V 0402)
C72  value 0.1uF  [C0402[1005X55]]  (hidden comment: 0.1uF 100V 0402)
C73  value 10nF  [C0402[1005X55]]  (hidden comment: 10nF 50V 0402)
C74  value 10uF  [C0603[1608X92]]  (hidden comment: 10uF 16V 0603)
C75  value 10uF  [C0603[1608X92]]  (hidden comment: 10uF 16V 0603)
C76  value 0.1uF  [C0402[1005X55]]  (hidden comment: 0.1uF 100V 0402)
C77  value 0.1uF  [C0402[1005X55]]  (hidden comment: 0.1uF 100V 0402)
C78  value 0.1uF  [C0402[1005X55]]  (hidden comment: 0.1uF 100V 0402)
C79  value 4.7uF  [C0402[1005X55]]  (hidden comment: 4.7uF 6.3V 0402)
C80  value 4.7nF  [C0402[1005X55]]  (hidden comment: 4.7nF 50V 0402)
C81  value 1uF  [C0402[1005X55]]  (hidden comment: 1uF 6.3V 0402)
C82  value 1uF  [C0402[1005X55]]  (hidden comment: 1uF 6.3V 0402)
C83  value 1uF  [C0402[1005X55]]  (hidden comment: 1uF 6.3V 0402)
C84  value 4.7uF  [C0402[1005X55]]  (hidden comment: 4.7uF 6.3V 0402)
C85  value 4.7uF  [C0402[1005X55]]  (hidden comment: 4.7uF 6.3V 0402)
C86  value 1uF  [C0402[1005X55]]  (hidden comment: 1uF 6.3V 0402)
C87  value 33pF  [C0402[1005X55]]  (hidden comment: 33pF 50V 0402)
C88  value 4.7nF  [C0402[1005X55]]  (hidden comment: 4.7nF 50V 0402)
D13  PMEG6020ER  [SOD-123]
D14  LED_0603_GREEN_5mA  [LED0603]  (value not drawn)
JP3  COIL  [JST-SH-2-SMD-HORZ]
R13  value 10R  [R0402[1005]]  (hidden comment: 10R 1% 0402)
R14  value 1K  [R0402[1005]]  (hidden comment: 1K 1% 0402)
R15  value 1R  [R0402[1005]]  (hidden comment: 1R 1% 0402)
R16  value 1R  [R0402[1005]]  (hidden comment: 1R 1% 0402)
R17  value 0.02R  [R0805[2012]]  (hidden comment: 0.02R 1% 0805)
R18  value 10R  [R0402[1005]]  (hidden comment: 10R 1% 0402)
R19  value 475R  [R0402[1005]]  (hidden comment: 475R 1% 0402)
R20  value 523K  [R0402[1005]]  (hidden comment: 523K 1% 0402)
R21  value 523K  [R0402[1005]]  (hidden comment: 523K 1% 0402)
R22  value 22R  [R0402[1005]]  (hidden comment: 22R 1% 0402)
R23  value 100K  [R0402[1005]]  (hidden comment: 100K 1% 0402)
R24  value 12.1K  [R0402[1005]]  (hidden comment: 12.1K 1% 0402)
R25  value 10R  [R0402[1005]]  (hidden comment: 10R 1% 0402)
R26  value 10K  [R0402[1005]]  (hidden comment: 10K 1% 0402)
R27  value 10K  [R0402[1005]]  (hidden comment: 10K 1% 0402)
R28  value 10R  [R0402[1005]]  (hidden comment: 10R 1% 0402)
R29  value 10K  [R0402[1005]]  (hidden comment: 10K 1% 0402)
R30  value 10K  [R0402[1005]]  (hidden comment: 10K 1% 0402)
R31  value 10K  [R0402[1005]]  (hidden comment: 10K 1% 0402)
R32  value 10K  [R0402[1005]]  (hidden comment: 10K 1% 0402)
R33  value 76K8  [R0402[1005]]  (hidden comment: 76K8 1% 0402)
R34  value 10K  [R0402[1005]]  (hidden comment: 10K 1% 0402)
R35  value 10K  [R0402[1005]]  (hidden comment: 10K 1% 0402)
R36  value 10R  [R0402[1005]]  (hidden comment: 10R 1% 0402)
R37  value 475R  [R0402[1005]]  (hidden comment: 475R 1% 0402)
R38  value 10R  [R0402[1005]]  (hidden comment: 10R 1% 0402)
R39  value 3K6  [R0402[1005]]  (hidden comment: 3K6 1% 0402)
R40  value 3K6  [R0402[1005]]  (hidden comment: 3K6 1% 0402)
R41  value 48K7  [R0402[1005]]  (hidden comment: 48K7 1% 0402)
R42  value 56K2  [R0402[1005]]  (hidden comment: 56K2 1% 0402)
R43  value 53K6  [R0402[1005]]  (hidden comment: 53K6 1% 0402)
R44  value 56K2  [R0402[1005]]  (hidden comment: 56K2 1% 0402)
U1  BQ500212ARGZR  [QFN-48 (0.5MM)]
U11  CSD97394Q4M  [VSON-CLIP]
U12  CSD97394Q4M  [VSON-CLIP]
U13  INA199A1DCKR  [DCK0006A_M]

### Ports
WRLS_STATUS (out)

### Nets
5V: C65.1 C70.2 C71.2 R13.1 R17.2 R33.1 U11.1(SKIP#) U11.2(VDD) U12.1(SKIP#) U12.2(VDD)
GND: C65.2 C69.1 C70.1 C71.1 C73.1 C74.1 C75.1 C79.1 C81.1 C82.2 C84.1 C85.2 C86.2 C87.1 C88.1 D14.C R21.1 R27.1 R28.2 R29.1 R30.2 R34.2 R39.1 R40.1 R44.1 U1.20(GND) U1.32(DGND) U1.36(AGND) U1.47(AGND) U1.48(ADCREF) U1.49(EPAD) U11.3(PGND) U11.9(EP) U12.3(PGND) U12.9(EP) U13.1(REF) U13.2(GND)
VCC: C73.2 C81.2 C83.2 C84.2 R22.1 R24.2 R26.1 R31.2 R32.2 R35.2 U1.2(T_SENSE) U1.33(V33D) U13.3(V+)
COMM+: R25.1 U1.37(COMM_A+) U1.39(COMM_B+)
COMM-: R28.1 U1.38(COMM_A-) U1.40(COMM_B-)
ISENSE: C69.2 R14.2 U1.42(I_SENSE)
PWM_A: R36.2 R40.2 U11.8(PWM)
PWM_B: R38.2 R39.2 U12.8(PWM)
SNOOZE_CAP: R20.2 U1.3(SNOOZE_CAP)
SNOOZE_CHG: R19.1 U1.22(SNOOZE_CHG)
NetC66_1: C66.1 R15.2
NetC66_2: C66.2 U11.7(BOOT)
NetC67_1: C67.1 U12.7(BOOT)
NetC67_2: C67.2 R16.1
NetC68_1: C68.1 R18.2 U13.4(IN+)
NetC68_2: C68.2 R13.2 U13.5(IN-)
NetC72_1: C72.1 C76.1 C77.1 C78.1 C80.2 JP3.2
NetC72_2: C72.2 C76.2 C77.2 C78.2 U12.4(VSW)
NetC74_2: C74.2 C75.2 R17.1 R18.1 U11.5(VIN) U12.5(VIN)
NetC79_2: C79.2 D13.1(K) R20.1 R21.2
NetC80_1: C80.1 R23.2
NetC82_1: C82.1 C85.1 R22.2 U1.34(V33A)
NetC83_1: C83.1 C86.1 U1.35(BPCAP)
NetC87_2: C87.2 R23.1 R24.1 R25.2 R27.2
NetC88_2: C88.2 R33.2 R34.1 U1.46(V_IN)
NetD13_2: D13.2(A) R19.2
NetD14_A: D14.A R37.1
NetJP3_1: JP3.1 U11.4(VSW)
NetR14_1: R14.1 U13.6(OUT)
NetR15_1: R15.1 U11.6(BOOT_R)
NetR16_2: R16.2 U12.6(BOOT_R)
NetR26_2: R26.2 U1.5(~{RESET})
NetR29_2: R29.2 U1.31(GND)
NetR30_1: R30.1 U1.1(PEAK_DET)
NetR31_1: R31.1 U1.11(DATA)
NetR32_1: R32.1 U1.10(CLK)
NetR35_1: R35.1 U1.45(V33D)
NetR36_1: R36.1 U1.12(PWM_A)
NetR37_2: R37.2 U1.7(LED_A) ; port WRLS_STATUS
NetR38_1: R38.1 U1.13(PWM_B)
NetR41_1: R41.1 R42.1 R43.1 U1.43(LOSS_THR)
NetR41_2: R41.2 U1.17(FOD)
NetR42_2: R42.2 U1.16(PMOD)
NetR43_2: R43.2 U1.15(FOD_CAL)
NetR44_2: R44.2 U1.44(LED_MODE)

Not connected (* = marked no-connect by the designer): U1 4(NC) 6(SLEEP) 8(LED_B) 9(SNOOZE) 14(RESERVED) 18(LED_C) 19(RESERVED) 21(DOUT_TX) 23(BUZ_AC) 24(BUZ_DC) 25(RESERVED) 26(RESERVED) 27(RESERVED) 28(RESERVED) 29(RESERVED) 30(RESERVED) 41(RESERVED)

### Library data of the parts
C65 = CAP_47uF_6.3V_1210_10%: as C61 on sheet Power; Mounting Technology: Surface Mount; PackageReference: 1210; PackageDescription: 1210 (3225 Metric); Voltage: 6.3V; Tolerance: 10%
C66 C67 C72 C76-C78 = CAP_0.1uF_100V_0402_10%: as C60 on sheet Power; Mounting Technology: Surface Mount; PackageReference: 0402; PackageDescription: 0402 (1005 Metric); Voltage: 100V; Tolerance: 10%
C68 C70 C71 C81-C83 C86 = CAP_1uF_6.3V_0402_10%: as C47 on sheet Magnetometer; Mounting Technology: Surface Mount; PackageReference: 0402; PackageDescription: 0402 (1005 Metric); Voltage: 6.3V; Tolerance: 10%
C69 = CAP_0.1uF_6.3V_0402_10%: as C58 on sheet MCU; Mounting Technology: Surface Mount; PackageReference: 0402; PackageDescription: 0402 (1005 Metric); Voltage: 6.3V; Tolerance: 10%
C73 = CAP_10nF_50V_0402_10%: as C40 on sheet DW1000; Mounting Technology: Surface Mount; PackageReference: 0402; PackageDescription: 0402 (1005 Metric); Voltage: 50V; Tolerance: 10%
C74 C75 = CAP_10uF_16V_0603_10%: 10uF 16V 10% 0603 (1608 Metric); PartNumber: GRM188R61C106KAALD; Manufacturer: Murata; Mounting Technology: Surface Mount; PackageReference: 0603; PackageDescription: 0603 (1608 Metric); Voltage: 16V; Tolerance: 10%
C79 C84 C85 = CAP_4.7uF_6.3V_0402_20%: as C48 on sheet MCU; Mounting Technology: Surface Mount; PackageReference: 0402; PackageDescription: 0402 (1005 Metric); Voltage: 6.3V; Tolerance: 20%
C80 C88 = CAP_4.7nF_50V_0402_10%: 4.7nF 50V 10% 0402 (1005 Metric); PartNumber: GRM155R71H472KA01D; Manufacturer: Murata; Mounting Technology: Surface Mount; PackageReference: 0402; PackageDescription: 0402 (1005 Metric); Voltage: 50V; Tolerance: 10%
C87 = CAP_33pF_50V_0402_1%: 33pF 50V 1% 0402 (1005 Metric); PartNumber: GCM1555C1H330FA16D; Manufacturer: Murata; Mounting Technology: Surface Mount; PackageReference: 0402; PackageDescription: 0402 (1005 Metric); Voltage: 50V; Tolerance: 1%
D13 = PMEG6020ER: as D10 on sheet Power; PackageDescription: SOD, 2-Leads, Body 2.69x1.6mm; PackageReference: SOD-123W; Mounting Technology: Surface Mount
D14 = LED_0603_GREEN_5mA: as D12 on sheet Power; PackageReference: 0603; PackageDescription: 0603 (1608 Metric); Mounting Technology: Surface Mount
JP3 = JST_SH_2_HORZ: Manufacturer: JST Sales America, Inc.; PartNumber: SM02B-SRSS-TB; Mounting Technology: Surface Mount; PackageReference: JST-SH
R13 R18 R25 R28 R36 R38 = RES_10R_0402_1%: 10R 0.063W 1% 0402 (1005 Metric); Manufacturer: KOA Speer; PartNumber: RK73H1ETTP10R0F; Tolerance: 1%; Power: 0.063W; Mounting Technology: Surface Mount; PackageReference: 0402; PackageDescription: 0402 (1005 Metric); ComponentLink1Description: Datasheet; ComponentLink1URL: http://www.koaspeer.com/catimages/Products/RK73H/RK73H.pdf
R14 = RES_1K_0402_1%: 1K 0.063W 1% 0402 (1005 Metric); Manufacturer: KOA Speer; PartNumber: RK73H1ETTP1001F; Tolerance: 1%; Power: 0.063W; Mounting Technology: Surface Mount; PackageReference: 0402; PackageDescription: 0402 (1005 Metric); ComponentLink1Description: Datasheet; ComponentLink1URL: http://www.koaspeer.com/catimages/Products/RK73H/RK73H.pdf
R15 R16 = RES_1R_0402_1%: 1R 0.063W 1% 0402 (1005 Metric); Manufacturer: KOA Speer; PartNumber: RK73H1ETTP1R00F; Tolerance: 1%; Power: 0.063W; Mounting Technology: Surface Mount; PackageReference: 0402; PackageDescription: 0402 (1005 Metric); ComponentLink1Description: Datasheet; ComponentLink1URL: http://www.koaspeer.com/catimages/Products/RK73H/RK73H.pdf
R17 = RES_0.02R_0805_1%: 0.02R 0.5W 1% 0805 (2012 Metric); Manufacturer: Bourns; PartNumber: CRF0805-FZ-R020ELF; Tolerance: 1%; Power: 0.5W; Mounting Technology: Surface Mount; PackageReference: 0805; PackageDescription: 0805 (2012 Metric)
R19 R37 = RES_475R_0402_1%: 475R 0.063W 1% 0402 (1005 Metric); Manufacturer: KOA Speer; PartNumber: RK73H1ETTP4750F; Tolerance: 1%; Power: 0.063W; Mounting Technology: Surface Mount; PackageReference: 0402; PackageDescription: 0402 (1005 Metric); ComponentLink1Description: Datasheet; ComponentLink1URL: http://www.koaspeer.com/catimages/Products/RK73H/RK73H.pdf
R20 R21 = RES_523K_0402_1%: 523K 0.063W 1% 0402 (1005 Metric); Manufacturer: KOA Speer; PartNumber: RK73H1ETTP5233F; Tolerance: 1%; Power: 0.063W; Mounting Technology: Surface Mount; PackageReference: 0402; PackageDescription: 0402 (1005 Metric); ComponentLink1Description: Datasheet; ComponentLink1URL: http://www.koaspeer.com/catimages/Products/RK73H/RK73H.pdf
R22 = RES_22R_0402_1%: as R8 on sheet MCU; Tolerance: 1%; Power: 0.063W; Mounting Technology: Surface Mount; PackageReference: 0402; PackageDescription: 0402 (1005 Metric); ComponentLink1Description: Datasheet; ComponentLink1URL: http://www.koaspeer.com/catimages/Products/RK73H/RK73H.pdf
R23 = RES_100K_0402_1%: as R11 on sheet Power; Tolerance: 1%; Power: 0.063W; Mounting Technology: Surface Mount; PackageReference: 0402; PackageDescription: 0402 (1005 Metric); ComponentLink1Description: Datasheet; ComponentLink1URL: http://www.koaspeer.com/catimages/Products/RK73H/RK73H.pdf
R24 = RES_12.1K_0402_1%: 12.1K 0.063W 1% 0402 (1005 Metric); Manufacturer: KOA Speer; PartNumber: RK73H1ETTP1212F; Tolerance: 1%; Power: 0.063W; Mounting Technology: Surface Mount; PackageReference: 0402; PackageDescription: 0402 (1005 Metric); ComponentLink1Description: Datasheet; ComponentLink1URL: http://www.koaspeer.com/catimages/Products/RK73H/RK73H.pdf
R26 R27 R29-R32 R34 R35 = RES_10K_0402_1%: as R10 on sheet MCU; Tolerance: 1%; Power: 0.063W; Mounting Technology: Surface Mount; PackageReference: 0402; PackageDescription: 0402 (1005 Metric); ComponentLink1Description: Datasheet; ComponentLink1URL: http://www.koaspeer.com/catimages/Products/RK73H/RK73H.pdf
R33 = RES_76K8_0402_1%: 76K8 0.063W 1% 0402 (1005 Metric); Manufacturer: KOA Speer; PartNumber: RK73H1ETTP7682F; Tolerance: 1%; Power: 0.063W; Mounting Technology: Surface Mount; PackageReference: 0402; PackageDescription: 0402 (1005 Metric); ComponentLink1Description: Datasheet; ComponentLink1URL: http://www.koaspeer.com/catimages/Products/RK73H/RK73H.pdf
R39 R40 = RES_3K6_0402_1%: 3K6 0.063W 1% 0402 (1005 Metric); Manufacturer: KOA Speer; PartNumber: RK73H1ETTP3601F; Tolerance: 1%; Power: 0.063W; Mounting Technology: Surface Mount; PackageReference: 0402; PackageDescription: 0402 (1005 Metric); ComponentLink1Description: Datasheet; ComponentLink1URL: http://www.koaspeer.com/catimages/Products/RK73H/RK73H.pdf
R41 = RES_48K7_0402_1%: 48K7 0.063W 1% 0402 (1005 Metric); Manufacturer: KOA Speer; PartNumber: RK73H1ETTP4872F; Tolerance: 1%; Power: 0.063W; Mounting Technology: Surface Mount; PackageReference: 0402; PackageDescription: 0402 (1005 Metric); ComponentLink1Description: Datasheet; ComponentLink1URL: http://www.koaspeer.com/catimages/Products/RK73H/RK73H.pdf
R42 R44 = RES_56K2_0402_1%: 56K2 0.063W 1% 0402 (1005 Metric); Manufacturer: KOA Speer; PartNumber: RK73H1ETTP5622F; Tolerance: 1%; Power: 0.063W; Mounting Technology: Surface Mount; PackageReference: 0402; PackageDescription: 0402 (1005 Metric); ComponentLink1Description: Datasheet; ComponentLink1URL: http://www.koaspeer.com/catimages/Products/RK73H/RK73H.pdf
R43 = RES_53K6_0402_1%: 53K6 0.063W 1% 0402 (1005 Metric); Manufacturer: KOA Speer; PartNumber: RK73H1ETTP5362F; Tolerance: 1%; Power: 0.063W; Mounting Technology: Surface Mount; PackageReference: 0402; PackageDescription: 0402 (1005 Metric); ComponentLink1Description: Datasheet; ComponentLink1URL: http://www.koaspeer.com/catimages/Products/RK73H/RK73H.pdf
U1 = BQ500212ARGZR: IC, Qi Compliant Wireless Power Transmitter Manager; Manufacturer: Texas Instruments; PackageReference: VQFN-48; PartNumber: BQ500212ARGZR; Mounting Technology: Surface Mount
U11 U12 = CSD97394Q4M: Manufacturer: Texas Instruments; PartNumber: CSD97394Q4M; Mounting Technology: Surface Mount; PackageReference: VSON-CLIP
U13 = CMP-0704-00049-2: Voltage Output, High or Low Side Measurement, Bi-Directional Zero-Drift Series, 2.7 to 26 V, -40 to 125 degC, 6-pin SOT23 (DCK6), Green (RoHS & no Sb/Br); Vs(Min)(V): 2.7; Small-Signal Bandwidth(Typ)(MHz): 0.03; CMRR(Min)(dB): 100; Common Mode Range(Min)(V): -0.3; Common Mode Range(Max)(V): 26; SubFamily: Current Shunt Monitor; Input Offset (+/-)(Max)(uV): 150; Gain(V/V): 50; Quiescent Current (+/-)(Typ)(mA): 0.065; Rating: Catalog; Input Offset Drift (+/-)(Max)(uV/Degrees Celsius): 0.5; Mounting Technology: Surface Mount; PackageDescription: 6-Pin Plastic Small Outline, Body 2 x 1.25 mm, Pitch 0.65 mm; PackageReference: DCK0006A; Eco-Plan: Green (RoHS & no Sb/Br); PackageVersion: 4093553-4/G, 01/2007; DatasheetVersion: SBOS469D; ComponentLink2Description: Datasheet; ComponentLink3URL: http://www.ti.com/lit/ds/symlink/ina212-q1.pdf; Code_JEDEC: MO-203; ComponentLink3Description: Package Specification; ComponentLink1URL: http://www.ti.com/; ComponentLink1Description: Manufacturer URL; Vs(Max)(V): 26; ComponentLink2URL: http://www.ti.com/general/docs/lit/getliterature.tsp?genericPartNumber=INA199A1&fileType=pdf; Output Type: Voltage; PartNumber: INA199A1DCKR

## Nets that join several sheets
5V: LEDs (5 pins), Power (6 pins), WirelessPower (10 pins)
GND: MCU (17 pins), DW1000 (36 pins), Barometer (C1.1 U2.3 U2.4 U2.5), 1 (C44_1.1 U5_1.1 U5_1.4), 2 (C44_2.1 U5_2.1 U5_2.4), 3 (C44_3.1 U5_3.1 U5_3.4), 4 (C44_4.1 U5_4.1 U5_4.4), LEDs (D1.3 D2.3 D3.3 D4.3), Magnetometer (6 pins), Power (21 pins), WirelessPower (37 pins)
VCC: MCU (15 pins), DW1000 (17 pins), Barometer (C1.2 U2.1 U2.2), 1 (C44_1.2 U5_1.2), 2 (C44_2.2 U5_2.2), 3 (C44_3.2 U5_3.2), 4 (C44_4.2 U5_4.2), Magnetometer (6 pins), Power (C64.2 L5.2 R12.2 U10.3), WirelessPower (13 pins)
I2C.SCL: Barometer (U2.8), Magnetometer (U6.1)
I2C.SDA: Barometer (U2.7), Magnetometer (U6.11)
NetD4_4: MCU (U7.26), LEDs (D4.4 R5.1)
NetR37_2: MCU (U7.62), WirelessPower (R37.2 U1.7)
NetU4_45: MCU (U7.24), DW1000 (U4.45)
NetU5_1_3: MCU (U7.15), 1 (U5_1.3)
NetU5_2_3: MCU (U7.58), 2 (U5_2.3)
NetU5_3_3: MCU (U7.41), 3 (U5_3.3)
NetU5_4_3: MCU (U7.37), 4 (U5_4.3)